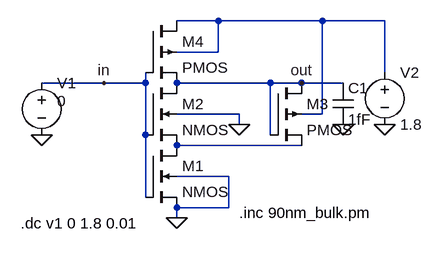
[diagram p0: schematic proposed.asc]
proposed.asc, the LTspice schematic file:
Version 4
SHEET 1 880 680
WIRE 256 48 192 48
WIRE 416 48 256 48
WIRE 512 48 416 48
WIRE 256 96 256 48
WIRE 256 96 192 96
WIRE 512 128 512 48
WIRE 80 144 -16 144
WIRE 144 144 144 128
WIRE 144 144 80 144
WIRE 336 144 192 144
WIRE 384 144 336 144
WIRE 448 144 384 144
WIRE 288 192 192 192
WIRE 416 192 416 48
WIRE 416 192 384 192
WIRE 288 208 288 192
WIRE 144 224 144 144
WIRE 336 224 336 144
WIRE 384 240 192 240
WIRE 272 288 192 288
WIRE 144 320 144 224
WIRE 272 336 272 288
WIRE 272 336 192 336
WIRE 192 352 192 336
FLAG -16 224 0
FLAG 512 208 0
FLAG 448 208 0
FLAG 80 144 in
FLAG 384 144 out
FLAG 288 208 0
FLAG 192 352 0
SYMBOL nmos4 144 240 R0
SYMATTR InstName M1
SYMATTR Value2 l=100n w=180n
SYMBOL nmos4 144 144 R0
SYMATTR InstName M2
SYMATTR Value2 l=100n w=180n
SYMBOL pmos4 336 144 R0
SYMATTR InstName M3
SYMATTR Value2 l=100n w=300n
SYMBOL pmos4 144 48 R0
SYMATTR InstName M4
SYMATTR Value2 l=100n w=300n
SYMBOL voltage -16 128 R0
WINDOW 3 24 44 Left 2
WINDOW 123 0 0 Left 0
WINDOW 39 0 0 Left 0
SYMATTR Value 0
SYMATTR InstName V1
SYMBOL voltage 512 112 R0
SYMATTR InstName V2
SYMATTR Value 1.8
SYMBOL cap 432 144 R0
SYMATTR InstName C1
SYMATTR Value 1fF
TEXT -48 360 Left 2 !.dc v1 0 1.8 0.01
TEXT 288 344 Left 2 !.inc 90nm_bulk.pm

The netlist it stands for:
* proposed.asc
M1 N002 in 0 0 NMOS l=100n w=180n
M2 out in N002 0 NMOS l=100n w=180n
M3 out out N002 N001 PMOS l=100n w=300n
M4 N001 in out N001 PMOS l=100n w=300n
V1 in 0 0
V2 N001 0 1.8
C1 out 0 1fF
.model NMOS NMOS
.model PMOS PMOS
.lib standard.mos
.dc v1 0 1.8 0.01
.inc 90nm_bulk.pm
.backanno
.end